# Altium schematic sheet P03_Battery Circuit.SchDoc
size 246 x 182 mm
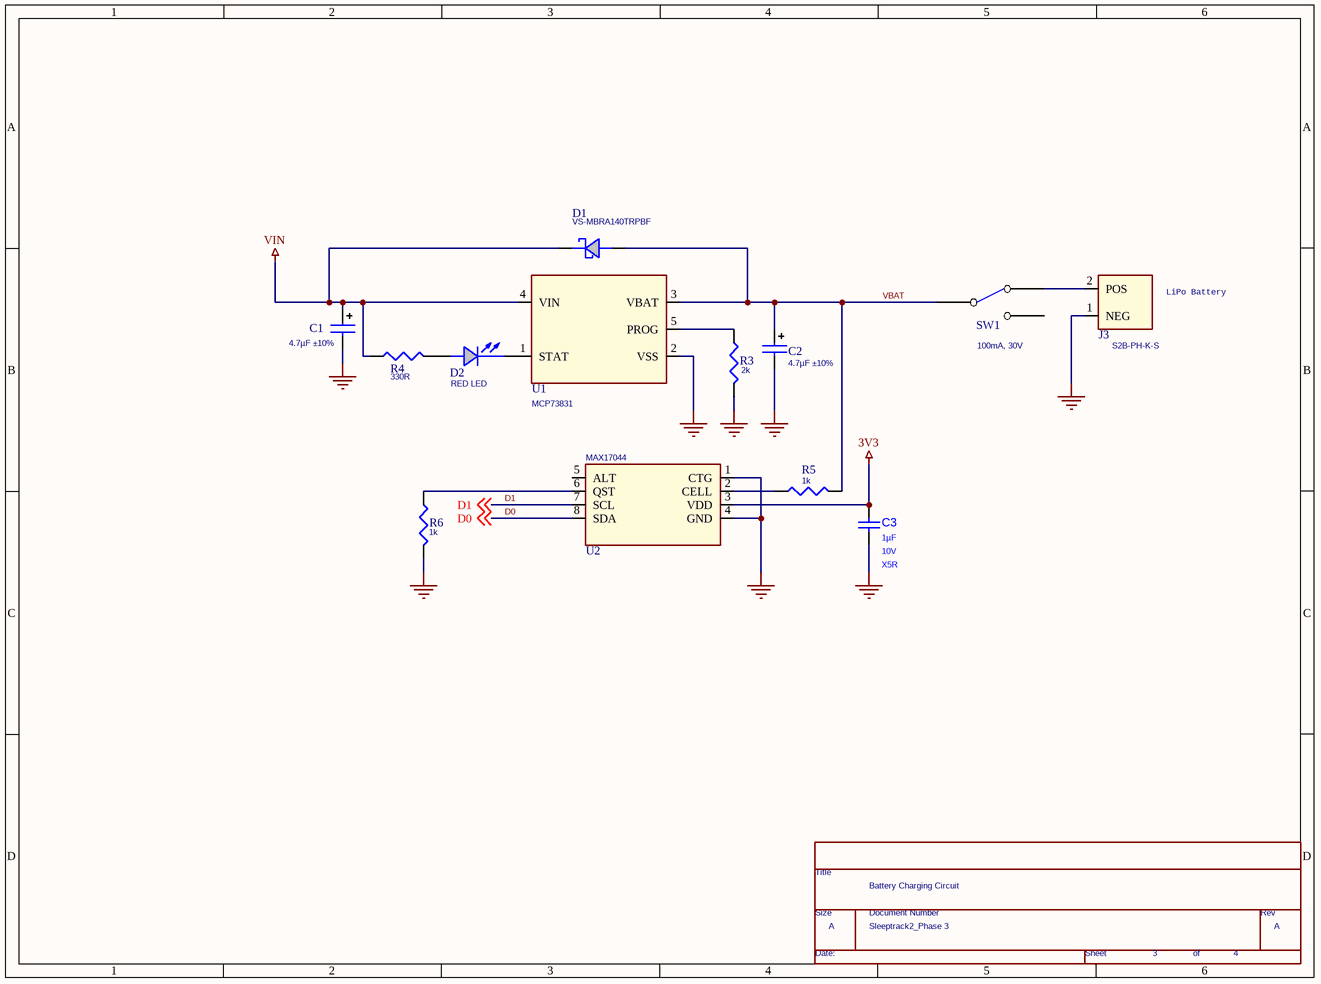
[diagram p0: P03_Battery Circuit.SchDoc]

## Parts
*  Doc: Sleeptrack2_Phase 3  RevCode: A  Title: Battery Charging Circuit  Page Number: 3  Page Count: 4  (hidden comment: TitleBlock0)  (graphical)
C1  4.7µF ±10%  [CAPCP1206]
C2  4.7µF ±10%  [CAPCP1206]
C3  ValueDisplayed: 1µF  Value2: 10V  TempCo: X5R  [0402]  (hidden comment: GRM155R61A105KE15D)
D1  VS-MBRA140TRPBF  [D0-214AC]
D2  RED LED  [LED0402N]
J3  S2B-PH-K-S  [S2B-PH-K-S]
R3  2k  [RESC402N]
R4  330R  [RESC402N]
R5  1k  [RESC402N]
R6  1k  [RESC402N]
SW1  100mA, 30V  [SS12DH2]
U1  MCP73831  [SOT95P270X145-5N]
U2  MAX17044  [SON50P300X100_HS-9M]

## Nets
3V3: C3.1 U2.3(VDD)
GND: C1.2 C2.2 C3.2 J3.1(NEG) R3.2 R6.2 U1.2(VSS) U2.1(CTG) U2.4(GND)
VIN: C1.1 D1.2(CATHODE) R4.1 U1.4(VIN)
D0: U2.8(SDA) ; off-sheet D0
D1: U2.7(SCL) ; off-sheet D1
VBAT: C2.1 D1.1(ANODE) R5.2 SW1.1(COMMON) U1.3(VBAT)
NetD2_1: D2.1(CATHODE) U1.1(STAT)
NetD2_2: D2.2(ANODE) R4.2
NetJ3_2: J3.2(POS) SW1.3(NO)
NetR3_1: R3.1 U1.5(PROG)
NetR5_1: R5.1 U2.2(CELL)
NetR6_1: R6.1 U2.6(QST)

Not connected (* = marked no-connect by the designer): SW1 2(NC); U2 5(ALT)

## Notes on the sheet
- LiPo Battery
- (in symbol TitleBlock0) Title; Size; Document Number; Rev; Date:; Sheet; of

## Library data of the parts
C1 C2 = 4.7µF ±10% Molded Tantalum Capacitors 6.3V 1206 (3216 Metric) 6 Ohm: T491A475K006AT
C3 = GRM155R61A105KE15D: CAP, CERM, 1 µF, 10 V, +/- 10%, X5R, 0402; Manufacturer: MuRata; Polarized: N; CompType: Capacitor; Value: 1uF; U/M: EA; Cap_F: 0.000001; Tolerance_%: 10; Value1: Unknown; TaMin_C: -55; TaMax_C: 85; AEC Category: Q200; SymbolVersion: 2008-07-09; PartNumber: GRM155R61A105KE15D; PackageReference: 0402; RoHS: Y; VDC_V: 10; MountType: SMT; Technology: Ceramic; Cap_Case: 0402; Published: 2008-06-19; Publisher: Texas Instruments; LatestRevisionDate: 2016-01-22; ComponentLink1Description: Datasheet link; ComponentLink1URL: http://search.murata.co.jp/Ceramy/PnsearchViewAction.do?HnOFG=ON&HnNFG=ON&SEL_CNT=50&sLang=en&sKey=GRM155R61A105KE15D&x=9&y=9&search=startwith; Supplier 1: Digi-Key; Supplier Part Number 1: 490-3890-1-ND; Supplier 2: Mouser; Supplier Part Number 2: 81-GRM155R61A105KE15; Supplier 3: Farnell; Supplier Part Number 3: 1735523; AEC Qualified: ?
D1 = VS-MBRA140TRPBF: Diode Schottky 40V 1A Surface Mount SMA
D2 = VLMS1500-GS08: Red 631nm LED Indication - Discrete 2V 0402 (1005 Metric)
J3 = S2B-PH-K-S: 2 Positions Header, Shrouded Connector 0.079" (2.00mm) Through Hole, Right Angle Tin
R3 = RC0402FR-072KL: RES SMD 2K OHM 1% 1/16W 0402
R4 = RC0402FR-07330RL: RES SMD 330R OHM 1% 1/16W 0402
R5 R6 = RC0402FR-071KL: RES SMD 1K OHM 1% 1/16W 0402
SW1 = SS12SDH2: Slide Switch SPDT Through Hole, Right Angle
U1 = MCP73831: Charger IC Lithium-Ion/Polymer SOT-23-5
U2 = MAX17044: Battery Battery Monitor IC Lithium-Ion/Polymer 8-TDFN (2x3)
* = TitleBlock0: Page Create Date: March  8, 1995; Page Size: A